# Altium schematic sheet block-diagram.SchDoc
size A4; SheetNumber: 1; SheetTotal: 2
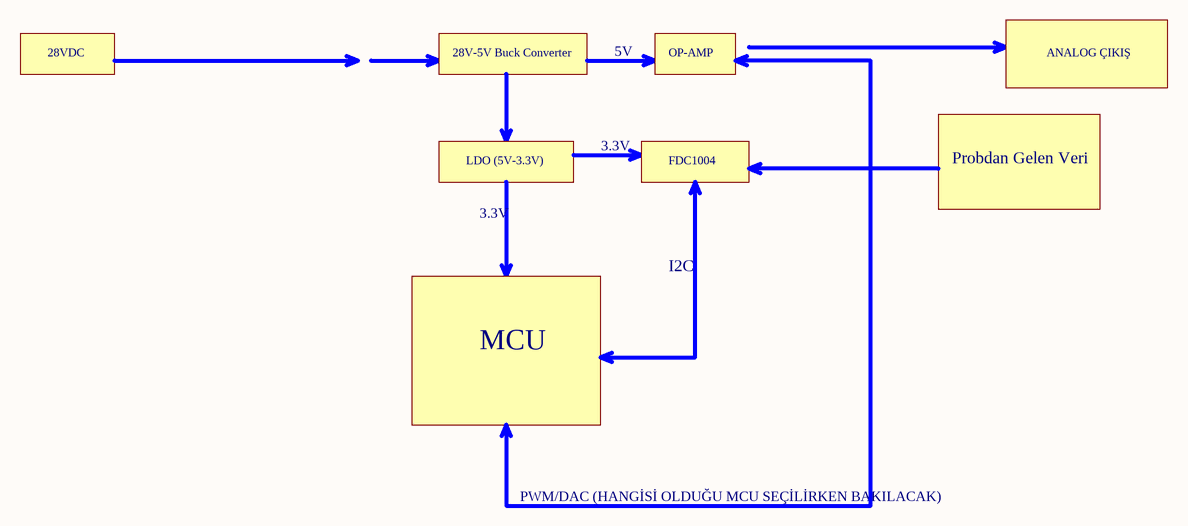
[diagram p0: block-diagram.SchDoc]

## Notes on the sheet
- 28VDC
- 28V-5V Buck Converter
- 5V
- OP-AMP
- ANALOG ÇIKIŞ
- LDO (5V-3.3V)
- 3.3V
- FDC1004
- Probdan Gelen Veri
- I2C
- MCU
- PWM/DAC (HANGİSİ OLDUĞU MCU SEÇİLİRKEN BAKILACAK)